# Altium project Estacion_Meteorologica_Final.PrjPcb
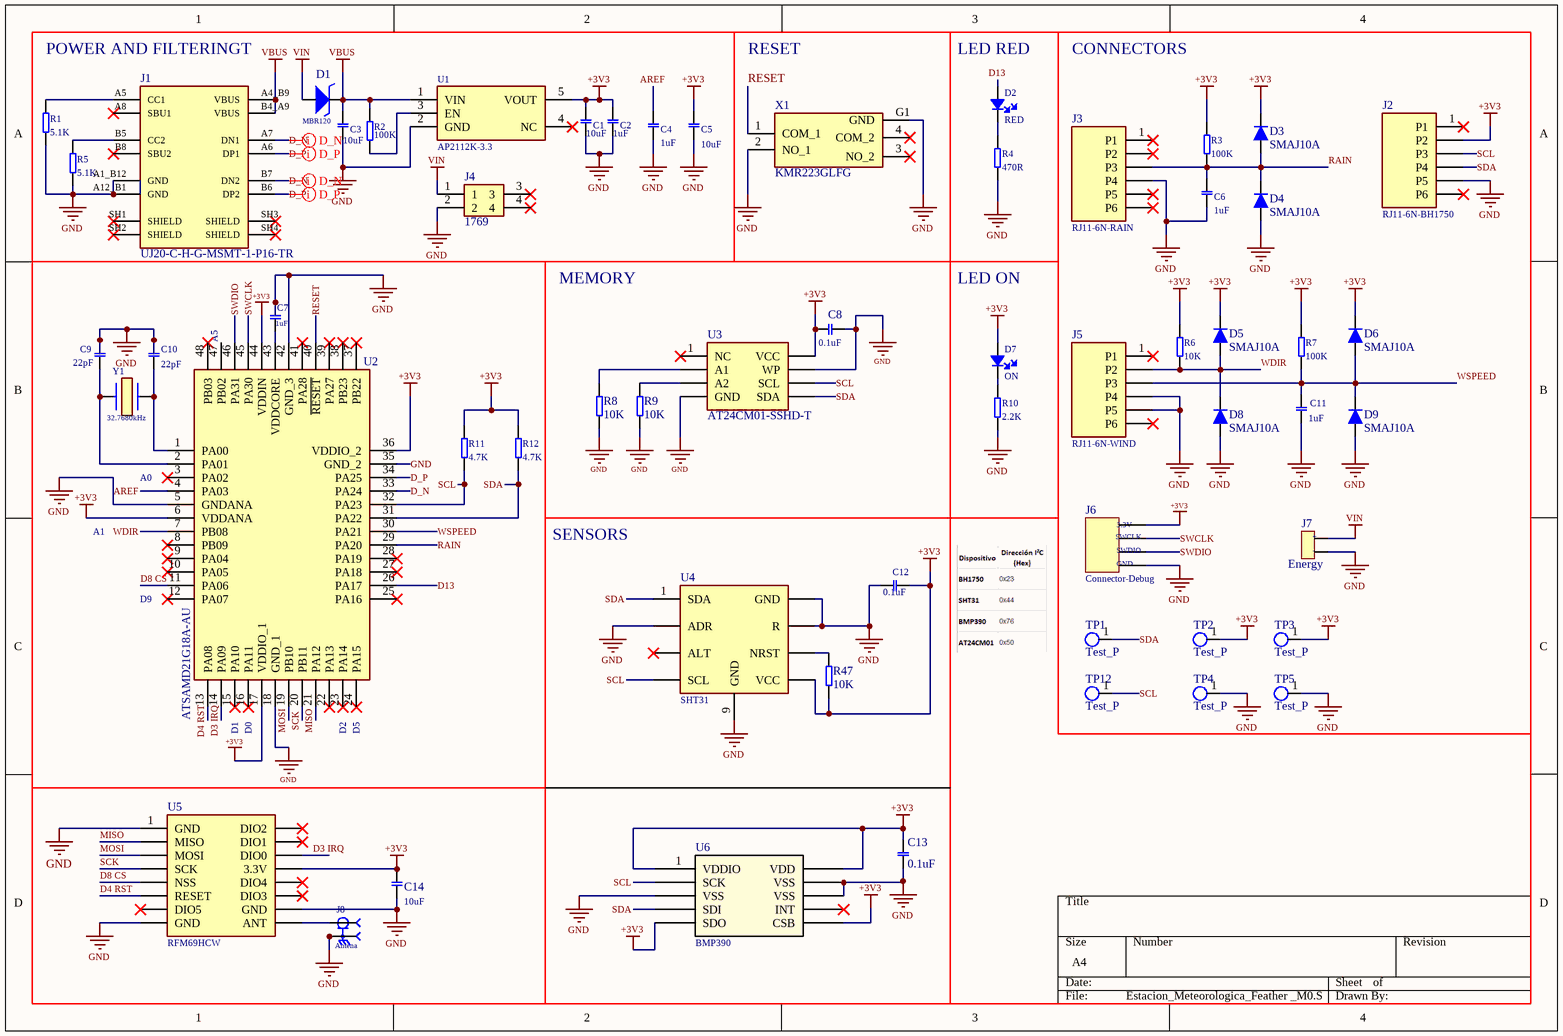
[diagram p0: Estacion_Meteorologica_Feather _M0.SchDoc]
3 sheets, 126 parts. Net scope: global (net labels, ports and power ports of the same name join across sheets).
Board files: Consola_ESP32.PcbDoc, Estacion_Meteorologica_Sensor_BH1750.PcbDoc, Estacion_Meteorologica_Feather _M0.PcbDoc, Consola_ESP32_V2.PcbDoc
Sheets:
  Estacion_Meteorologica_Feather _M0.SchDoc
  Estacion_Meteorologica_Sensor_BH1750.SchDoc
  Consola_ESP32_V2.SchDoc

## Sheet Estacion_Meteorologica_Feather _M0.SchDoc
size A4; SheetNumber: 1; SheetTotal: 4; SPICEModelCacheEYFLLTXP: <root> / <DocumentId>EYFLLTXP</DocumentId> / </root>

### Parts
C1  10uF  [CAPCP1608_0603]
C2  1uF  [CAPCP1608_0603]
C3  10uF  [CAPCP1608_0603]
C4  1uF  [CAPCP1608_0603]
C5  10uF  [CAPCP1608_0603]
C6  1uF  [CAPCP1608_0603]
C7  1uF  [CAPCP1608_0603]
C8  0.1uF  [CAPCP1608_0603]
C9  22pF  [CAPCP1608_0603]
C10  22pF  [CAPCP1608_0603]
C11  1uF  [CAPCP1608_0603]
C12  0.1uF  [CAPCP1608_0603]
C13  0.1uF  [CAPCP1608_0603]
C14  10uF  [CAPCP1608_0603]
D1  MBR120  [SODFL3616X98N]
D2  RED  [DIODO_0603]
D3  SMAJ10A  [DIOM4325X250N]
D4  SMAJ10A  [DIOM4325X250N]
D5  SMAJ10A  [DIOM4325X250N]
D6  SMAJ10A  [DIOM4325X250N]
D7  ON  [DIODO_0603]
D8  SMAJ10A  [DIOM4325X250N]
D9  SMAJ10A  [DIOM4325X250N]
J1  UJ20-C-H-G-MSMT-1-P16-TR  [uJ20-C-H-G-MSMT-1-P16-TR]
J2  RJ11-6N-BH1750  [TE_RJ11-6N-B]
J3  RJ11-6N-RAIN  [TE_RJ11-6N-B]
J4  1769  [1769_Conector_Bateria]
J5  RJ11-6N-WIND  [TE_RJ11-6N-B]
J6  Connector-Debug  [HDR1X4]
J7  Energy  [HDR1X2_2]
J8  Antena  [SAMTEC_RSP-122811-01]
R1  5.1K  [RESC1608_0603]
R2  100K  [RESC1608_0603]
R3  100K  [RESC1608_0603]
R4  470R  [RESC1608_0603]
R5  5.1K  [RESC1608_0603]
R6  10K  [RESC1608_0603]
R7  100K  [RESC1608_0603]
R8  10K  [RESC1608_0603]
R9  10K  [RESC1608_0603]
R10  2.2K  [RESC1608_0603]
R11  4.7K  [RESC1608_0603]
R12  4.7K  [RESC1608_0603]
R47  10K  [RESC1608_0603]
TP1  Test_P  [Test_point]
TP2  Test_P  [Test_point]
TP3  Test_P  [Test_point]
TP4  Test_P  [Test_point]
TP5  Test_P  [Test_point]
TP12  Test_P  [Test_point]
U1  AP2112K-3.3  [SOT-23-5]
U2  ATSAMD21G18A-AU  [QFP-48N]
U3  AT24CM01-SSHD-T  [SOIC-8N]
U4  SHT31  [SON50P250X250X90-9T110X180N]
U5  RFM69HCW  [COM-13909]
U6  BMP390  [10LGA_2X2X0p75_BOS-M]
X1  KMR223GLFG  [KMR223GLFG_Boton]
Y1  32.7680kHz  [XTAL 830050789]

### Nets
+3V3: C1.2 C2.2 C5.2 C8.1 C12.2 C13.2 C14.2 D3.2 D5.2 D6.2 D7.1 J2.2(P2) J6.1 R3.2 R6.2 R7.2 R11.2 R12.2 R47.1 TP2.1 TP3.1 U1.5(VOUT) U2.6(VDDANA) U2.17(VDDIO_1) U2.36(VDDIO_2) U2.44(VDDIN) U3.8(VCC) U4.5(VCC) U5.13(3.3V) U6.1(VDDIO) U6.5(SDO) U6.6(CSB) U6.10(VDD)
GND: C1.1 C2.1 C3.1 C4.1 C5.1 C6.1 C7.2 C8.2 C9.2 C10.2 C11.1 C12.1 C13.1 C14.1 D4.1 D8.1 D9.1 J1.A1_B12(GND) J1.A12_B1(GND) J2.5(P5) J3.4(P4) J4.2 J5.4(P4) J5.5(P5) J6.4 J7.2 J8.G1(GND) J8.G2(GND) R1.1 R4.1 R5.1 R8.1 R9.1 R10.2 TP4.1 TP5.1 U1.2(GND) U2.5(GNDANA) U2.18(GND_1) U2.35(GND_2) U2.42(GND_3) U3.4(GND) U3.7(WP) U4.2(ADR) U4.7(R) U4.8(GND) U4.9(GND) U5.1(GND) U5.8(GND) U5.10(GND) U6.3(VSS) U6.8(VSS) U6.9(VSS) X1.2(NO_1) X1.G1(GND)
VBUS: C3.2 D1.2 J1.A4_B9(VBUS) J1.B4_A9(VBUS) R2.2 U1.1(VIN)
VIN: D1.1 J4.1 J7.1
AREF: C4.2 U2.4(PA03)
D3 IRQ: U2.14(PA09) U5.14(DIO0)
D4 RST: U2.13(PA08) U5.6(RESET)
D8 CS: U2.11(PA06) U5.5(NSS)
D13: D2.1 U2.26(PA17)
D_N: J1.A7(DN1) J1.B7(DN2) U2.33(PA24)
D_P: J1.A6(DP1) J1.B6(DP2) U2.34(PA25)
MISO: U2.21(PA12) U5.2(MISO)
MOSI: U2.19(PB10) U5.3(MOSI)
RAIN: C6.2 D3.1 D4.2 J3.3(P3) R3.1 U2.29(PA20)
RESET: U2.40(~{RESET}) X1.1(COM_1)
SCK: U2.20(PB11) U5.4(SCK)
SCL: J2.3(P3) R11.1 TP12.1 U2.32(PA23) U3.6(SCL) U4.4(SCL) U6.2(SCK)
SDA: J2.4(P4) R12.1 TP1.1 U2.31(PA22) U3.5(SDA) U4.1(SDA) U6.4(SDI)
SWCLK: J6.2 U2.45(PA30)
SWDIO: J6.3 U2.46(PA31)
WDIR: D5.1 D8.2 J5.2(P2) R6.1 U2.7(PB08)
WSPEED: C11.2 D6.1 D9.2 J5.3(P3) R7.1 U2.30(PA21)
NetC7_1: C7.1 U2.43(VDDCORE)
NetC9_1: C9.1 U2.2(PA01) Y1.1
NetC10_1: C10.1 U2.1(PA00) Y1.2
NetD2_2: D2.2 R4.2
NetD7_2: D7.2 R10.1
NetJ1_A5: J1.A5(CC1) R1.2
NetJ1_B5: J1.B5(CC2) R5.2
NetJ8_1: J8.1 U5.9(ANT)
NetR2_1: R2.1 U1.3(EN)
NetR8_2: R8.2 U3.2(A1)
NetR9_2: R9.2 U3.3(A2)
NetR47_2: R47.2 U4.6(NRST)

Not connected (* = marked no-connect by the designer): J1 A8(SBU1)* B8(SBU2)* SH1(SHIELD)* SH2(SHIELD)* SH3(SHIELD)* SH4(SHIELD)*; J2 1(P1)* 6(P6)*; J3 1(P1)* 2(P2)* 5(P5)* 6(P6)*; J4 3* 4*; J5 1(P1)* 6(P6)*; U1 4(NC)*; U2 3(PA02)* 8(PB09)* 9(PA04)* 10(PA05)* 12(PA07)* 15(PA10)* 16(PA11)* 22(PA13)* 23(PA14)* 24(PA15)* 25(PA16)* 27(PA18)* 28(PA19)* 37(PB22)* 38(PB23)* 39(PA27)* 41(PA28)* 47(PB02) 48(PB03)*; U3 1(NC)*; U4 3(ALT)*; U5 7(DIO5)* 11(DIO3)* 12(DIO4)* 15(DIO1)* 16(DIO2)*; U6 7(INT)*; X1 3(NO_2)* 4(COM_2)*

### Layout directives
differential pair: D_N, D_P

### Notes on the sheet
- POWER AND FILTERINGT
- RESET
- (near D2) LED RED
- CONNECTORS
- MEMORY
- LED ON
- (near U2) A5
- (near U2) A0
- A1
- SENSORS
- (near U2) D9
- (near U2) D1
- (near U2) D0
- (near U2) D2
- (near U2) D5
- (in symbol Connector_04_debug) 3.3V; SWCLK; SWDIO; GND
- (in symbol Connector_energy) +; -

### Library data of the parts
C1 C3 C5 C14 = C0603X100J1GACAUTO: Capacitor_10uF_0603
C2 C4 C6 C7 C11 = C0603X105J4RACTU: Capacitor_1uF_0603
C8 C12 C13 = 06035C104K4T4A: Capacitor_0.1uF_0603
C9 C10 = C0603C220J1GAC: Capacitor_22pF_0603
D1 = MBR120ESFT3G: Diodo_Zenner_Sod-123FL-2
D2 D7 = SML-D12D1WT86: LED_NARANJA_0603
D3-D6 D8 D9 = SMAJ10A: TVS Diode 10V 400W Unidirectional SMAJ10A (DO-214AC)
J1 = UJ20-C-H-G-MSMT-1-P16-TR: Conector usb c; Package: None; Price: None; Value: *; MP: UJ20-C-H-G-MSMT-1-P16-TR; Availability: Unavailable
J2 J3 J5 = RJ11-6N-B: 6 Position 1 Port Right Angle RJ11 Low Profile Filtered EMI/RFI Modular Jack; MF: TE Connectivity; MP: RJ11-6N-B; Price: None; Purchase-URL: https://pricing.snapeda.com/search/part/RJ11-6N-B/?ref=eda; Package: None; Check_prices: https://www.snapeda.com/parts/RJ11-6N-B/TE+Connectivity+Corcom+Filters/view-part/?ref=eda; Value: *; Availability: In Stock; SnapEDA_Link: https://www.snapeda.com/parts/RJ11-6N-B/TE+Connectivity+Corcom+Filters/view-part/?ref=snap
J4 = 1769: Adafruit Accessories JST-PH 2-pin SMT Right Angle Connect; Geometry.Height: 5.5mm; Mouser Part Number: 485-1769; Mouser Price/Stock: https://www.mouser.co.uk/ProductDetail/Adafruit/1769?qs=GURawfaeGuBbgoGtf2XstA%3D%3D; Manufacturer_Name: Adafruit; Manufacturer_Part_Number: 1769; Datasheet Link: https://cdn-shop.adafruit.com/datasheets/17311.pdf
J6 = Connector_04_debug
J7 = Connector_energy: Conector de gestor de carga
J8 = RSP-122811-01: U.FL (UMCC), IPEX MHF1 Connector Receptacle, Male Pin 50Ohm Surface Mount Solder; Availability: Unavailable; MP: RSP-122811-01; Value: *; Price: None; Package: None
R1 R5 = RCA06035K10JNEA: Resistencia_5.1K_0603
R2 R3 R7 = RCA0603100KFKEAHP: Resistencia_100K_0603
R4 = RCA0603470RFKEA: Resistencia_470R_0603
R6 R8 R9 R47 = RCA060310K0JNEA: Resistencia_10K_0603
R10 = RCA06032K21FKTA: Resistencia_2.2K_0603
R11 R12 = RCA06034K70FKEA: Resistencia_4.7K_0603
TP1-TP5 TP12 = Test_point
U1 = AP2112K-3.3TRG1: 600mA 3.3V LDO Regulator Enable SOT23-5 DiodesZetex AP2112K-3.3TRG1, LDO Voltage Regulator, 3.3 V +/-1.5%, 2.5  6 Vin, 5-Pin SOT-23; Manufacturer_Name: Diodes Incorporated; Geometry.Height: 1.4mm; Mouser Part Number: 621-AP2112K-3.3TRG1; Mouser Price/Stock: https://www.mouser.co.uk/ProductDetail/Diodes-Incorporated/AP2112K-3.3TRG1?qs=x6A8l6qLYDDPYHosCdzh%2FA%3D%3D; Manufacturer_Part_Number: AP2112K-3.3TRG1; Datasheet Link: https://www.diodes.com//assets/Datasheets/AP2112.pdf
U2 = ATSAMD21G18A-AU: ARM Microcontrollers - MCU 256KB 32KB 48TQFP GRN1.6-3.6V48MHz; Manufacturer_Name: Microchip; Geometry.Height: 1.2mm; Mouser Part Number: 556-ATSAMD21G18A-AU; Mouser Price/Stock: https://www.mouser.co.uk/ProductDetail/Microchip-Technology/ATSAMD21G18A-AU?qs=KLFHFgXTQiDh1vL0VLU76Q%3D%3D; Manufacturer_Part_Number: ATSAMD21G18A-AU; Datasheet Link: https://datasheet.lcsc.com/lcsc/1810010234_Microchip-Tech-ATSAMD21G18A-AU_C78624.pdf
U3 = AT24CM01-SSHD-T: EEPROM SERIAL EEPROM, 1M 2-WIR-8 SOIC; Manufacturer_Name: Microchip; Geometry.Height: 1.75mm; Mouser Part Number: 556-AT24CM01-SSHD-T; Mouser Price/Stock: https://www.mouser.co.uk/ProductDetail/Microchip-Technology/AT24CM01-SSHD-T?qs=s44pgLhgXQig9Z6HBeFbBg%3D%3D; Manufacturer_Part_Number: AT24CM01-SSHD-T; Datasheet Link: https://4donline.ihs.com/images/VipMasterIC/IC/ATML/ATML-S-A0000726505/ATML-S-A0000726505-1.pdf?hkey=EF798316E3902B6ED9A73243A3159BB0
U4 = SHT31: Humidity Temperature Sensor 0 ~ 100% RH Analog Voltage Â±2% RH 8s Surface Mount; MF: Sensirion AG; Package: VFDFN-8 Sensirion AG; Price: None; MP: SHT31; Purchase-URL: https://pricing.snapeda.com/search/part/SHT31/?ref=eda; Availability: In Stock; Value: *; Check_prices: https://www.snapeda.com/parts/SHT31/Sensirion+AG/view-part/?ref=eda; SnapEDA_Link: https://www.snapeda.com/parts/SHT31/Sensirion+AG/view-part/?ref=snap
U5 = COM-13909: Rfm69hcw Wireless Transceiver 91; Value: *; MP: COM-13909; Package: None; Availability: Unavailable; Price: None
U6 = BMP390: Barometric Pressure Sensor, I2C/SPI, 300-1250 hPa; Mfr_Name: Bosch Sensortec; RefDes: RefDes; Type: Type
X1 = KMR223GLFG_1: Tactile Switch SPST-NO Top Actuated Surface Mount; Manufacturer_Name: C & K COMPONENTS; Geometry.Height: 1.9mm; Mouser Part Number: 611-KMR223GLFG; Mouser Price/Stock: https://www.mouser.co.uk/ProductDetail/CK/KMR223GLFG?qs=sb%252But3Lm4x2f%252B935G%252B3m6Q%3D%3D; Manufacturer_Part_Number: KMR223GLFG; Datasheet Link: https://www.ckswitches.com/media/1479/kmr2.pdf
Y1 = 830050789: XTAL 32.7680kHz 20ppm 2.0 x 1.2mm

## Sheet Estacion_Meteorologica_Sensor_BH1750.SchDoc
size A4; SheetNumber: 2; SheetTotal: 4
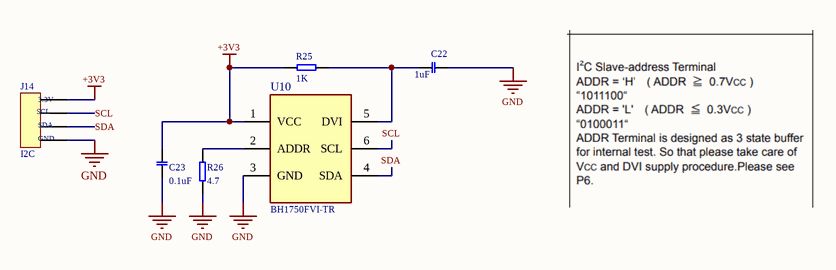
[diagram p1: Estacion_Meteorologica_Sensor_BH1750.SchDoc]

### Parts
C22  1uF  [CAPCP1608_0603]
C23  0.1uF  [CAPCP1608_0603]
J14  I2C  [HDR1X4]
R25  1K  [RESC1608_0603]
R26  4.7  [RESC1608_0603]
U10  BH1750FVI-TR  [XDCR_BH1750FVI-TR]

### Nets
+3V3: C23.2 J14.1 R25.1 U10.1(VCC)
GND: C22.2 C23.1 J14.4 R26.1 U10.3(GND)
SCL: J14.2 U10.6(SCL)
SDA: J14.3 U10.4(SDA)
NetC22_1: C22.1 R25.2 U10.5(DVI)
NetR26_2: R26.2 U10.2(ADDR)

### Notes on the sheet
- (in symbol Connector_04) 3.3V; SCL; SDA; GND

### Library data of the parts
C22 = C0603X105J4RACTU: Capacitor_1uF_0603
C23 = 06035C104K4T4A: Capacitor_0.1uF_0603
J14 = Connector_04
R25 = RCA06031K00JNEA: Resistencia_1K_0603
R26 = RCA06034K70FKEA: Resistencia_4.7K_0603
U10 = BH1750FVI-TR: Optical Sensor Ambient 560nm IÂ²C 6-SMD, Flat Lead Exposed Pad; MF: Rohm; Value: *; SnapEDA_Link: https://www.snapeda.com/parts/BH1750FVI-TR/Rohm/view-part/?ref=snap; Purchase-URL: https://pricing.snapeda.com/search/part/BH1750FVI-TR/?ref=eda; Availability: In Stock; Price: None; Package: SMD-6 ROHM Semiconductor; Check_prices: https://www.snapeda.com/parts/BH1750FVI-TR/Rohm/view-part/?ref=eda; MP: BH1750FVI-TR

## Sheet Consola_ESP32_V2.SchDoc
size A4; SheetNumber: 4; SheetTotal: 4
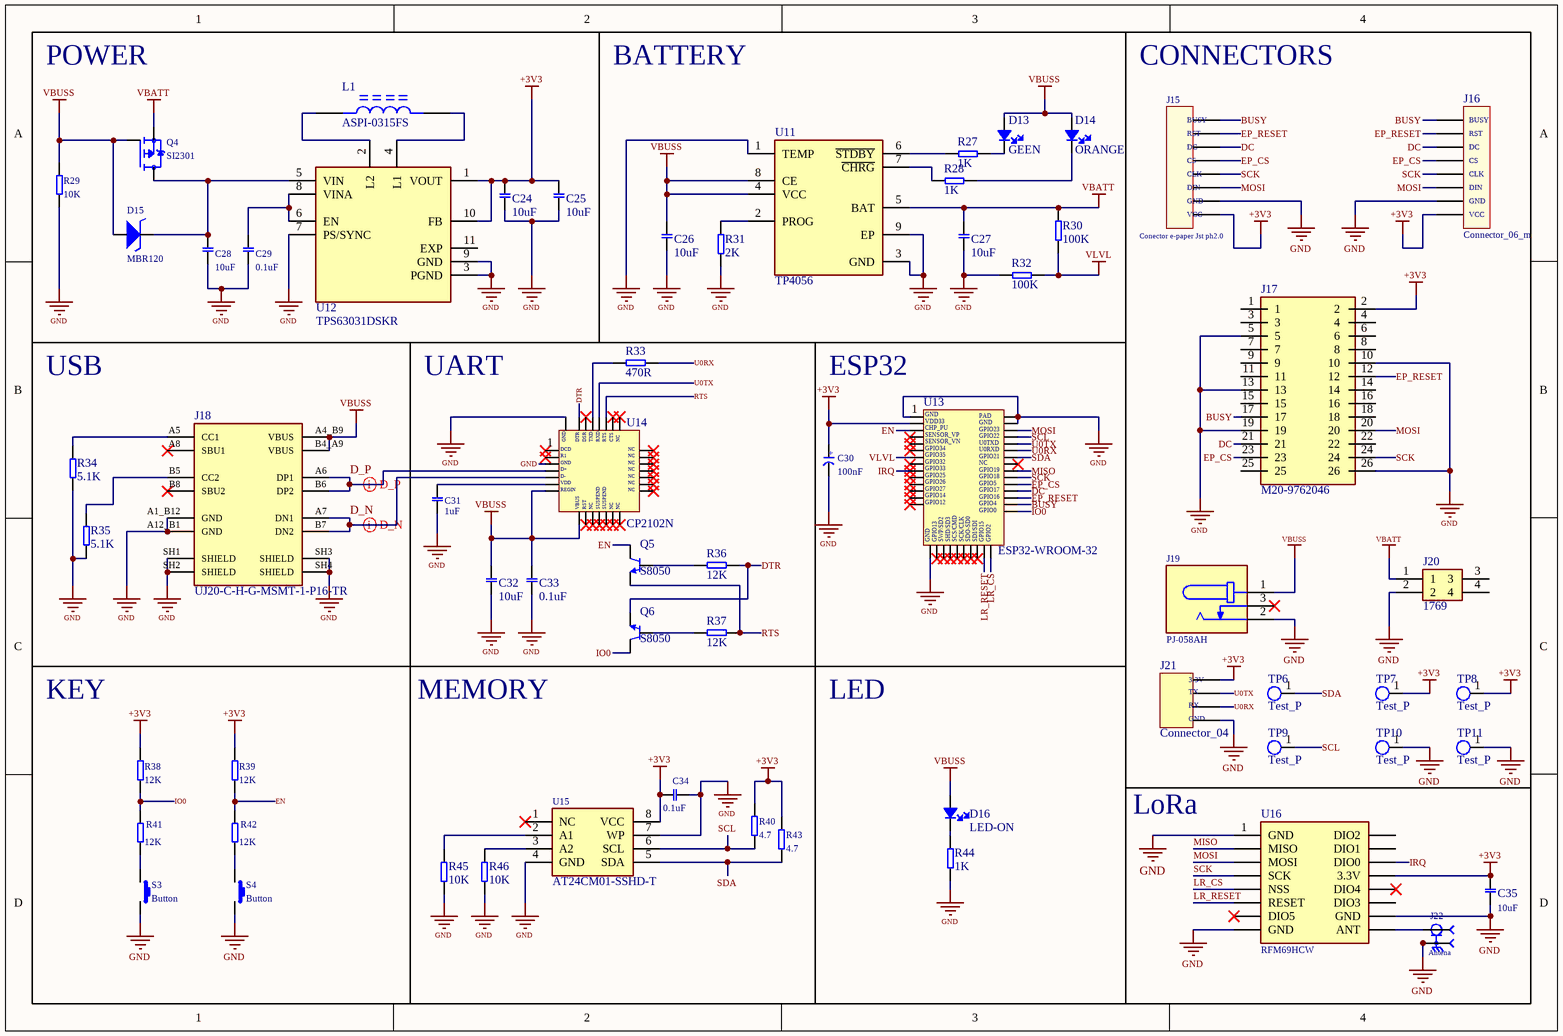
[diagram p2: Consola_ESP32_V2.SchDoc]

### Parts
C24  10uF  [CAPCP1608_0603]
C25  10uF  [CAPCP1608_0603]
C26  10uF  [CAPCP1608_0603]
C27  10uF  [CAPCP1608_0603]
C28  10uF  [CAPCP1608_0603]
C29  0.1uF  [CAPCP1608_0603]
C30  100nF  [CAPC_1206]
C31  1uF  [CAPCP1608_0603]
C32  10uF  [CAPCP1608_0603]
C33  0.1uF  [CAPCP1608_0603]
C34  0.1uF  [CAPCP1608_0603]
C35  10uF  [CAPCP1608_0603]
D13  GEEN  [DIODO_0603]
D14  ORANGE  [DIODO_0603]
D15  MBR120  [SODFL3616X98N]
D16  LED-ON  [DIODO_0603]
J15  Conector e-paper Jst ph2.0  [CONN_S8B-PH-SM4-TB_JST]
J16  Connector_06_m  [HDR1X8]
J17  M20-9762046  [HARWIN_M20-9762046]
J18  UJ20-C-H-G-MSMT-1-P16-TR  [uJ20-C-H-G-MSMT-1-P16-TR]
J19  PJ-058AH  [CUI_PJ-058AH]
J20  1769  [1769_Conector_Bateria]
J21  Connector_04  [HDR1X4]
J22  Antena  [SAMTEC_RSP-122811-01]
L1  ASPI-0315FS  [IND_ASPI-0315FS-1R0N-T2]
Q4  SI2301  [SOT-23]
Q5  S8050  [SOT23_8050_JY3]
Q6  S8050  [SOT23_8050_JY3]
R27  1K  [RESC1608_0603]
R28  1K  [RESC1608_0603]
R29  10K  [RESC1608_0603]
R30  100K  [RESC1608_0603]
R31  2K  [RESC1608_0603]
R32  100K  [RESC1608_0603]
R33  470R  [RESC1608_0603]
R34  5.1K  [RESC1608_0603]
R35  5.1K  [RESC1608_0603]
R36  12K  [RESC1608_0603]
R37  12K  [RESC1608_0603]
R38  12K  [RESC1608_0603]
R39  12K  [RESC1608_0603]
R40  4.7  [RESC1608_0603]
R41  12K  [RESC1608_0603]
R42  12K  [RESC1608_0603]
R43  4.7  [RESC1608_0603]
R44  1K  [RESC1608_0603]
R45  10K  [RESC1608_0603]
R46  10K  [RESC1608_0603]
S3  Button  [Button_3_4_2]
S4  Button  [Button_3_4_2]
TP6  Test_P  [Test_point]
TP7  Test_P  [Test_point]
TP8  Test_P  [Test_point]
TP9  Test_P  [Test_point]
TP10  Test_P  [Test_point]
TP11  Test_P  [Test_point]
U11  TP4056  [SOP127P600X175-9N]
U12  TPS63031DSKR  [SON50P250X250X80-11N]
U13  ESP32-WROOM-32  [ESP32]
U14  CP2102N  [QFN_CP2102]
U15  AT24CM01-SSHD-T  [SOIC-8N]
U16  RFM69HCW  [COM-13909]

### Nets
+3V3: C24.2 C25.2 C30.2 C34.1 C35.2 J15.8 J16.8 J17.2 J21.1 R38.2 R39.2 R40.2 R43.1 TP7.1 TP8.1 U12.1(VOUT) U12.10(FB) U13.2 U15.8(VCC) U16.13(3.3V)
GND: C24.1 C25.1 C26.1 C27.1 C28.1 C29.1 C30.1 C31.2 C32.1 C33.1 C34.2 C35.1 J15.7 J16.7 J17.5 J17.10 J17.13 J17.19 J17.26 J18.A1_B12(GND) J18.A12_B1(GND) J18.SH1(SHIELD) J18.SH2(SHIELD) J18.SH3(SHIELD) J18.SH4(SHIELD) J19.2 J20.2 J21.4 J22.G1(GND) J22.G2(GND) R29.1 R31.2 R32.2 R34.1 R35.1 R44.1 R45.1 R46.1 S3.2 S4.2 TP10.1 TP11.1 U11.1(TEMP) U11.3(GND) U11.9(EP) U12.3(PGND) U12.7(PS/SYNC) U12.9(GND) U13.1 U13.15 U13.38 U13.39 U14.3 U14.29 U15.4(GND) U15.7(WP) U16.1(GND) U16.8(GND) U16.10(GND)
VBATT: C27.2 J20.1 Q4.2(S) R30.2 U11.5(BAT)
VBUSS: C26.2 C32.2 C33.2 D13.1 D14.1 D15.1 D16.1 J18.A4_B9(VBUS) J18.B4_A9(VBUS) J19.1 Q4.1(G) R29.2 U11.4(VCC) U11.8(CE) U14.7 U14.8
VLVL: R30.1 R32.1 U13.7
BUSY: J15.1 J16.1 J17.17 U13.26
D_N: J18.A7(DN1) J18.B7(DN2) U14.5
D_P: J18.A6(DP1) J18.B6(DP2) U14.4
DC: J15.3 J16.3 J17.21 U13.28
DTR: Q6.3 R36.2 U14.28
EN: Q5.1 R39.1 R42.2 U13.3
EP_CS: J15.4 J16.4 J17.23 U13.29
EP_RESET: J15.2 J16.2 J17.12 U13.27
IO0: Q6.1 R38.1 R41.2 U13.25
IRQ: U13.9 U16.14(DIO0)
LR_CS: U13.24 U16.5(NSS)
LR_RESET: U13.23 U16.6(RESET)
MISO: U13.31 U16.2(MISO)
MOSI: J15.6 J16.6 J17.20 U13.37 U16.3(MOSI)
RTS: Q5.3 R37.2 U14.24
SCK: J15.5 J16.5 J17.24 U13.30 U16.4(SCK)
SCL: R40.1 TP9.1 U13.36 U15.6(SCL)
SDA: R43.2 TP6.1 U13.33 U15.5(SDA)
U0RX: J21.3 R33.2 U13.34
U0TX: J21.2 U13.35 U14.25
NetC28_2: C28.2 D15.2 Q4.3(D) U12.5(VIN)
NetC29_2: C29.2 U12.6(EN) U12.8(VINA)
NetC31_1: C31.1 U14.6
NetD13_2: D13.2 R27.1
NetD14_2: D14.2 R28.1
NetD16_2: D16.2 R44.2
NetJ18_A5: J18.A5(CC1) R34.2
NetJ18_B5: J18.B5(CC2) R35.2
NetJ22_1: J22.1 U16.9(ANT)
NetL1_1: L1.1 U12.2(L2)
NetL1_2: L1.2 U12.4(L1)
NetQ5_2: Q5.2 R36.1
NetQ6_2: Q6.2 R37.1
NetR27_2: R27.2 U11.6(~{STDBY})
NetR28_2: R28.2 U11.7(~{CHRG})
NetR31_1: R31.1 U11.2(PROG)
NetR33_1: R33.1 U14.26
NetR41_1: R41.1 S3.1
NetR42_1: R42.1 S4.1
NetR45_2: R45.2 U15.2(A1)
NetR46_2: R46.2 U15.3(A2)

Not connected (* = marked no-connect by the designer): J17 1 3 4 6 7 8 9 11 14 15 16 18 22 25; J18 A8(SBU1)* B8(SBU2)*; J19 3*; J20 3 4; U12 11(EXP); U13 4* 5* 6* 8* 10* 11* 12* 13* 14* 16* 17* 18* 19* 20* 21* 22* 32*; U14 1* 2* 9* 10* 11* 12* 13* 14* 15* 16* 17* 18* 19* 20* 21* 22* 23* 27*; U15 1(NC)*; U16 7(DIO5)* 11(DIO3) 12(DIO4)* 15(DIO1) 16(DIO2)

### Layout directives
differential pair: D_N, D_P

### Notes on the sheet
- POWER
- BATTERY
- (near J15) CONNECTORS
- USB
- UART
- (near U13) ESP32
- KEY
- MEMORY
- LED
- LoRa
- (in symbol Connector_04_uart) 3.3V; TX; RX; GND
- (in symbol Connector_08_m) BUSY; RST; DC; CS; CLK; DIN; GND; VCC
- (in symbol CP2102N-A02-GQFN28R) GND; DTR; DSR; TXD; RXD; RTS; CTS; NC; DCD; R1; D+; D-; VDD; REGIN; VBUS; RST; SUSPEND
- (in symbol ESP32-WROOM-32) GND; VDD33; PAD; CHP_PU; SENSOR_VP; GPIO23; SENSOR_VN; GPIO22; GPIO34; U0TXD; GPIO35; U0RXD; GPIO32; GPIO21; GPIO33; NC; GPIO25; GPIO19; GPIO26; GPIO18; GPIO27; GPIO5; GPIO14; GPIO17; GPIO12; GPIO16; GPIO4; GPIO0; GPIO13; SWP/SD2; SHD/SD3; SCS/CMD; SCK/CLK; SDO-SD0; SDI/SDI; GPIO15; GPIO2
- (in symbol S8B-PH-SM4-TBLFSN) BUSY; RST; DC; CS; CLK; DIN; GND; VCC
- (in symbol TAJD107K016RNJ) +

### Library data of the parts
C24-C28 C32 C35 = C0603X100J1GACAUTO: Capacitor_10uF_0603
C29 C33 C34 = 06035C104K4T4A: Capacitor_0.1uF_0603
C30 = TAJD107K016RNJ: Capacitor_100uF_1206
C31 = C0603X105J4RACTU: Capacitor_1uF_0603
D13 D16 = SMLD12EN1WT86: LED_VERDE_0603
D14 = SML-D12D1WT86: LED_NARANJA_0603
D15 = MBR120ESFT3G: Diodo_Zenner_Sod-123FL-2
J15 = S8B-PH-SM4-TBLFSN: Connector e-paper; Mfr_Name: JST; RefDes: RefDes; Type: Type
J16 = Connector_08_m
J17 = M20-9762046: 2X20 - 2.54mm; Package: None; Price: None; Value: *; MP: M20-9762046; Availability: Unavailable
J18 = UJ20-C-H-G-MSMT-1-P16-TR: Conector usb c; Package: None; Price: None; Value: *; MP: UJ20-C-H-G-MSMT-1-P16-TR; Availability: Unavailable
J19 = PJ-058AH: 2.0 x 5.7 mm, 5.0 A, Horizontal, Through Hole, Locking Type, Dc Power Jack Connector; MF: CUI Devices; SnapEDA_Link: https://www.snapeda.com/parts/PJ-058AH/CUI+Devices/view-part/?ref=snap; Package: None; Value: *; CUI_purchase_URL: https://www.cuidevices.com/product/interconnect/connectors/dc-power-connectors/jacks/pj-058ah?utm_source=snapeda.com&utm_medium=referral&utm_campaign=snapedaBOM; MP: PJ-058AH; Check_prices: https://www.snapeda.com/parts/PJ-058AH/CUI+Devices/view-part/?ref=eda
J20 = 1769: as J4 on sheet Estacion_Meteorologica_Feather _M0; Mouser Part Number: 485-1769; Mouser Price/Stock: https://www.mouser.co.uk/ProductDetail/Adafruit/1769?qs=GURawfaeGuBbgoGtf2XstA%3D%3D; Manufacturer_Name: Adafruit; Manufacturer_Part_Number: 1769; Datasheet Link: https://cdn-shop.adafruit.com/datasheets/17311.pdf
J21 = Connector_04_uart
J22 = RSP-122811-01: as J8 on sheet Estacion_Meteorologica_Feather _M0; Availability: Unavailable; MP: RSP-122811-01; Value: *; Price: None; Package: None
L1 = ASPI-0315FS-1R0N-T2: Package: None; Price: None; Value: *; MP: ASPI-0315FS-1R0N-T2; Availability: Unavailable
Q4 = SI2301CDS-T1-GE3: P-Channel 20 V 3.1A (Tc) 860mW (Ta), 1.6W (Tc) Surface Mount SOT-23; MF: Vishay; Package: SOT-23-3 Vishay Siliconix; Price: None; Check_prices: https://www.snapeda.com/parts/SI2301CDS-T1-GE3/Vishay+Siliconix/view-part/?ref=eda; Value: *; SnapEDA_Link: https://www.snapeda.com/parts/SI2301CDS-T1-GE3/Vishay+Siliconix/view-part/?ref=snap; MP: SI2301CDS-T1-GE3; Availability: In Stock; Purchase-URL: https://pricing.snapeda.com/search?q=SI2301CDS-T1-GE3&ref=eda
Q5 Q6 = ASS8050-L-HF: Transistor_Sot_23_j3y
R27 R28 R44 = RCA06031K00JNEA: Resistencia_1K_0603
R29 R45 R46 = RCA060310K0JNEA: Resistencia_10K_0603
R30 R32 = RCA0603100KFKEAHP: Resistencia_100K_0603
R31 = RCA06032K00FKEA: Resistencia_2K_0603
R33 = RCA0603470RFKEA: Resistencia_470R_0603
R34 R35 = RCA06035K10JNEA: Resistencia_5.1K_0603
R36-R39 = RCA060312K0JNEA: Resistencia_12KR_0603
R40 R43 = RCA06034K70FKEA: Resistencia_4.7K_0603
R41 R42 = 12KR_0603_25w
S3 S4 = Button: Tactile Switch
TP6-TP11 = Test_point
U11 = TP4056: Linear Li-Ion charger IC, 4.2V CC/CV, up to 1A, auto-recharge, thermal regulation.; MF: NanJing Top Power ASIC Corp.; Check_prices: https://www.snapeda.com/parts/TP4056/NanJing+Top+Power+ASIC+Corp./view-part/?ref=eda; SnapEDA_Link: https://www.snapeda.com/parts/TP4056/NanJing+Top+Power+ASIC+Corp./view-part/?ref=snap; Price: None; Availability: Not in stock; Package: Package; MP: TP4056; Value: *
U12 = TPS63031DSKR: High Efficient Single Inductor Buck-Boost Converter with 1-A Switches; MP: TPS63031DSKR; Availability: Unavailable; Value: *; Package: None; Price: None
U13 = ESP32-WROOM-32: ESP-32_48Pines
U14 = CP2102N-A02-GQFN28R: Conversor USB a UART de Silicon Labs CP2102
U15 = AT24CM01-SSHD-T: as U3 on sheet Estacion_Meteorologica_Feather _M0; Mouser Part Number: 556-AT24CM01-SSHD-T; Mouser Price/Stock: https://www.mouser.co.uk/ProductDetail/Microchip-Technology/AT24CM01-SSHD-T?qs=s44pgLhgXQig9Z6HBeFbBg%3D%3D; Manufacturer_Part_Number: AT24CM01-SSHD-T; Datasheet Link: https://4donline.ihs.com/images/VipMasterIC/IC/ATML/ATML-S-A0000726505/ATML-S-A0000726505-1.pdf?hkey=EF798316E3902B6ED9A73243A3159BB0
U16 = COM-13909: Rfm69hcw Wireless Transceiver 91; Value: *; MP: COM-13909; Package: None; Availability: Unavailable; Price: None

## Nets that join several sheets
+3V3: Estacion_Meteorologica_Feather _M0 (33 pins), Estacion_Meteorologica_Sensor_BH1750 (C23.2 J14.1 R25.1 U10.1), Consola_ESP32_V2 (20 pins)
GND: Estacion_Meteorologica_Feather _M0 (55 pins), Estacion_Meteorologica_Sensor_BH1750 (5 pins), Consola_ESP32_V2 (59 pins)
D_N: Estacion_Meteorologica_Feather _M0 (J1.A7 J1.B7 U2.33), Consola_ESP32_V2 (J18.A7 J18.B7 U14.5)
D_P: Estacion_Meteorologica_Feather _M0 (J1.A6 J1.B6 U2.34), Consola_ESP32_V2 (J18.A6 J18.B6 U14.4)
MISO: Estacion_Meteorologica_Feather _M0 (U2.21 U5.2), Consola_ESP32_V2 (U13.31 U16.2)
MOSI: Estacion_Meteorologica_Feather _M0 (U2.19 U5.3), Consola_ESP32_V2 (5 pins)
SCK: Estacion_Meteorologica_Feather _M0 (U2.20 U5.4), Consola_ESP32_V2 (5 pins)
SCL: Estacion_Meteorologica_Feather _M0 (7 pins), Estacion_Meteorologica_Sensor_BH1750 (J14.2 U10.6), Consola_ESP32_V2 (R40.1 TP9.1 U13.36 U15.6)
SDA: Estacion_Meteorologica_Feather _M0 (7 pins), Estacion_Meteorologica_Sensor_BH1750 (J14.3 U10.4), Consola_ESP32_V2 (R43.2 TP6.1 U13.33 U15.5)